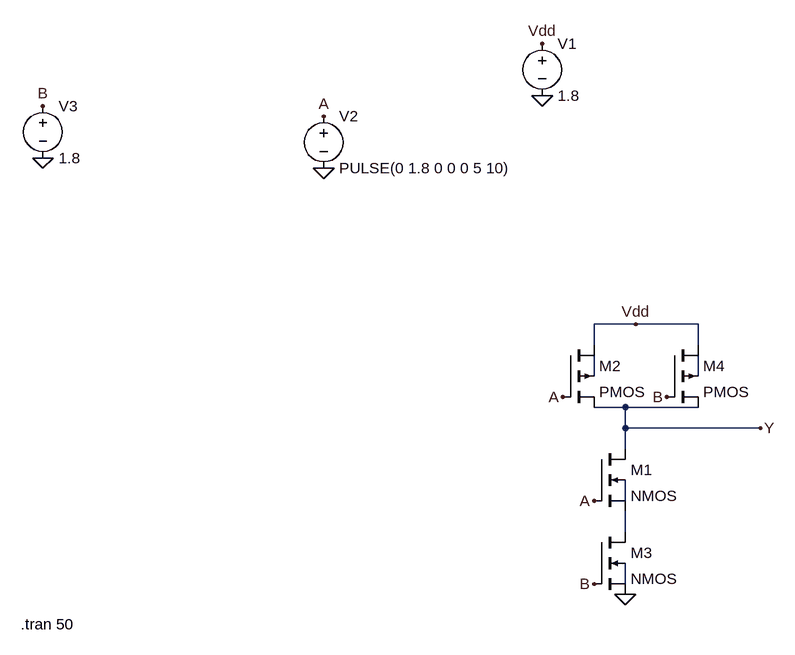
[diagram p0: schematic NAND.asc]
NAND.asc, the LTspice schematic file:
Version 4
SHEET 1 880 680
WIRE 176 0 112 0
WIRE 272 0 176 0
WIRE 112 32 112 0
WIRE 272 32 272 0
WIRE 112 80 112 48
WIRE 272 80 272 48
WIRE 160 128 112 128
WIRE 272 128 160 128
WIRE 160 160 160 128
WIRE 368 160 160 160
WIRE 160 192 160 160
WIRE 160 272 160 240
WIRE 160 320 160 288
WIRE 160 400 160 368
FLAG 32 -432 Vdd
FLAG 32 -352 0
FLAG -304 -320 A
FLAG -304 -240 0
FLAG 160 416 0
FLAG 176 0 Vdd
FLAG -736 -336 B
FLAG -736 -256 0
FLAG 64 112 A
FLAG 112 272 A
FLAG 224 112 B
FLAG 112 400 B
FLAG 368 160 Y
SYMBOL nmos4 112 192 R0
SYMATTR InstName M1
SYMATTR Value2 l=0.13u w=0.13u
SYMBOL pmos4 64 32 R0
SYMATTR InstName M2
SYMATTR Value2 l=0.13u w=0.13u
SYMBOL voltage 32 -448 R0
WINDOW 123 0 0 Left 0
WINDOW 39 0 0 Left 0
SYMATTR InstName V1
SYMATTR Value 1.8
SYMBOL voltage -304 -336 R0
WINDOW 123 0 0 Left 0
WINDOW 39 0 0 Left 0
SYMATTR InstName V2
SYMATTR Value PULSE(0 1.8 0 0 0 5 10)
SYMBOL nmos4 112 320 R0
SYMATTR InstName M3
SYMATTR Value2 l=0.13u w=0.13u
SYMBOL pmos4 224 32 R0
SYMATTR InstName M4
SYMATTR Value2 l=0.13u w=0.13u
SYMBOL voltage -736 -352 R0
WINDOW 123 0 0 Left 0
WINDOW 39 0 0 Left 0
SYMATTR InstName V3
SYMATTR Value 1.8
TEXT -770 462 Left 2 !.tran 50

The netlist it stands for:
* NAND.asc
M1 Y A N004 N003 NMOS l=0.13u w=0.13u
M2 Vdd A Y N001 PMOS l=0.13u w=0.13u
V1 Vdd 0 1.8
V2 A 0 PULSE(0 1.8 0 0 0 5 10)
M3 N004 B 0 N005 NMOS l=0.13u w=0.13u
M4 Vdd B Y N002 PMOS l=0.13u w=0.13u
V3 B 0 1.8
.model NMOS NMOS
.model PMOS PMOS
.lib standard.mos
.tran 50
.backanno
.end